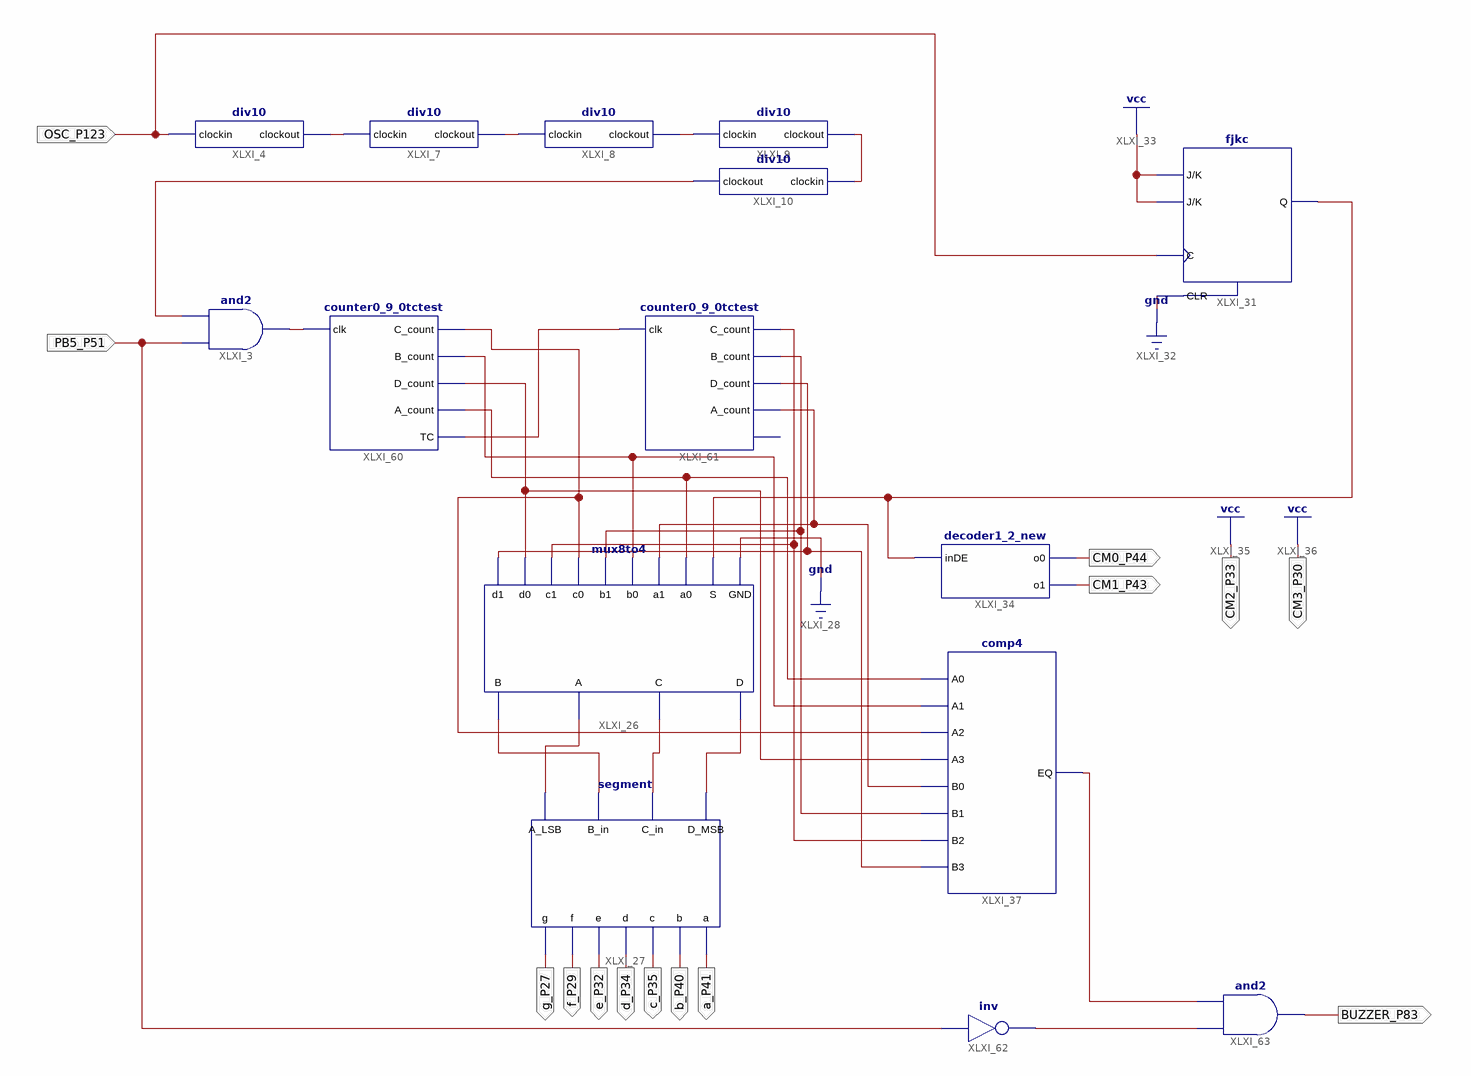
[diagram p0: schematic sheet 1]
// Xilinx ISE schematic lab6.sch (spartan6) as structural Verilog: 15 symbols, 14 ports
module lab6 (
  input  OSC_P123,
  input  PB5_P51,
  output g_P27,
  output f_P29,
  output e_P32,
  output d_P34,
  output c_P35,
  output b_P40,
  output a_P41,
  output CM0_P44,
  output CM1_P43,
  output CM2_P33,
  output CM3_P30,
  output BUZZER_P83
);

  wire XLXN_1, XLXN_2, XLXN_4, XLXN_5, XLXN_6, XLXN_8, XLXN_21, XLXN_33, XLXN_34, XLXN_35, XLXN_36, XLXN_37,
       XLXN_38, XLXN_39, XLXN_40, XLXN_41, XLXN_42, XLXN_43, XLXN_44, XLXN_53, XLXN_54, XLXN_56;

  div10 XLXI_4 (.clockin(OSC_P123), .clockout(XLXN_4));
  div10 XLXI_7 (.clockin(XLXN_4), .clockout(XLXN_5));
  div10 XLXI_8 (.clockin(XLXN_5), .clockout(XLXN_6));
  div10 XLXI_9 (.clockin(XLXN_6), .clockout(XLXN_8));
  div10 XLXI_10 (.clockin(XLXN_8), .clockout(XLXN_21));
  and XLXI_3 (XLXN_2, PB5_P51, XLXN_21);
  mux8to4 XLXI_26 (
    .GND(1'b0), .S(XLXN_53), .a0(XLXN_41), .a1(XLXN_37), .b0(XLXN_43), .b1(XLXN_39), .c0(XLXN_44),
    .c1(XLXN_40), .d0(XLXN_42), .d1(XLXN_38), .D(XLXN_35), .C(XLXN_34), .A(XLXN_36), .B(XLXN_33));
  segment XLXI_27 (
    .D_MSB(XLXN_35), .C_in(XLXN_34), .B_in(XLXN_33), .A_LSB(XLXN_36), .a(a_P41), .b(b_P40), .c(c_P35),
    .d(d_P34), .e(e_P32), .f(f_P29), .g(g_P27));
  fjkc XLXI_31 (.C(OSC_P123), .CLR(1'b0), .J(1'b1), .K(1'b1), .Q(XLXN_53));
  decoder1_2_new XLXI_34 (.inDE(XLXN_53), .o0(CM0_P44), .o1(CM1_P43));
  comp4 XLXI_37 (
    .A0(XLXN_41), .A1(XLXN_43), .A2(XLXN_44), .A3(XLXN_42), .B0(XLXN_37), .B1(XLXN_39), .B2(XLXN_40),
    .B3(XLXN_38), .EQ(XLXN_56));
  counter0_9_0tctest XLXI_60 (
    .clk(XLXN_2), .C_count(XLXN_44), .B_count(XLXN_43), .D_count(XLXN_42), .A_count(XLXN_41), .TC(XLXN_1));
  counter0_9_0tctest XLXI_61 (
    .clk(XLXN_1), .C_count(XLXN_40), .B_count(XLXN_39), .D_count(XLXN_38), .A_count(XLXN_37));  // open: TC
  not XLXI_62 (XLXN_54, PB5_P51);
  and XLXI_63 (BUZZER_P83, XLXN_54, XLXN_56);

  assign CM2_P33 = 1'b1;
  assign CM3_P30 = 1'b1;
endmodule
